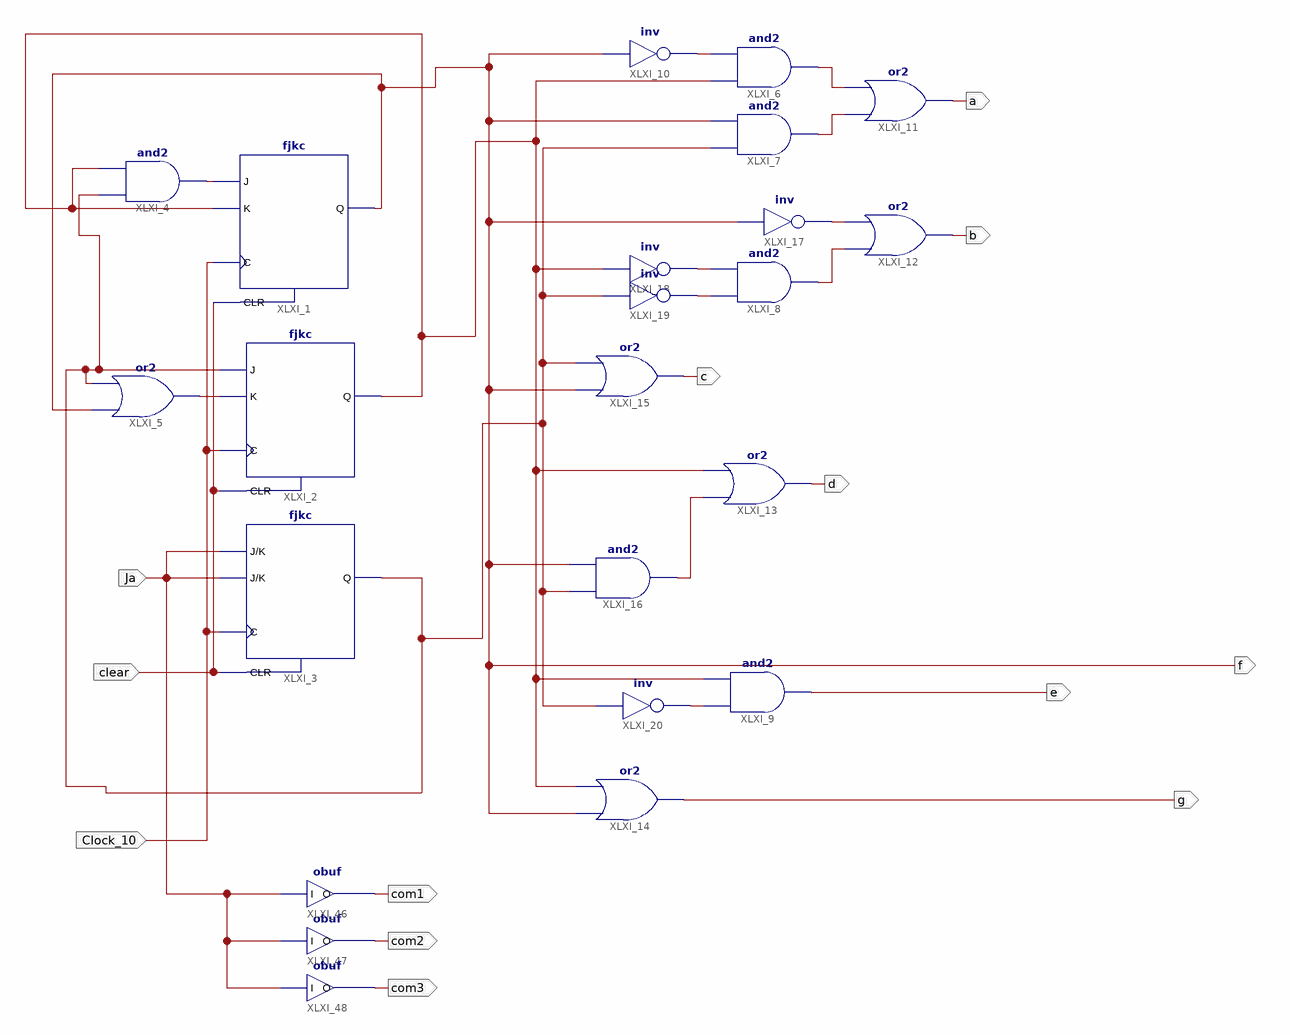
[diagram p0: schematic sheet 1]
// Xilinx ISE schematic seg7.sch (spartan6) as structural Verilog: 23 symbols, 13 ports
module seg7 (
  input  Clock_10,
  input  clear,
  input  Ja,
  output f,
  output g,
  output e,
  output d,
  output c,
  output a,
  output b,
  output com1,
  output com2,
  output com3
);

  wire XLXN_1, XLXN_2, XLXN_7, XLXN_9, XLXN_14, XLXN_15, XLXN_16, XLXN_17, XLXN_18, XLXN_19, XLXN_20,
       XLXN_30, XLXN_32;

  fjkc XLXI_1 (.C(Clock_10), .CLR(clear), .J(XLXN_1), .K(XLXN_7), .Q(f));
  fjkc XLXI_2 (.C(Clock_10), .CLR(clear), .J(XLXN_9), .K(XLXN_2), .Q(XLXN_7));
  and XLXI_4 (XLXN_1, XLXN_9, XLXN_7);
  or XLXI_5 (XLXN_2, f, XLXN_9);
  and XLXI_6 (XLXN_15, XLXN_7, XLXN_14);
  and XLXI_7 (XLXN_16, XLXN_9, f);
  and XLXI_8 (XLXN_32, XLXN_19, XLXN_18);
  and XLXI_9 (e, XLXN_20, XLXN_7);
  not XLXI_10 (XLXN_14, f);
  or XLXI_11 (a, XLXN_16, XLXN_15);
  or XLXI_12 (b, XLXN_32, XLXN_17);
  or XLXI_13 (d, XLXN_30, XLXN_7);
  or XLXI_14 (g, f, XLXN_7);
  or XLXI_15 (c, f, XLXN_9);
  and XLXI_16 (XLXN_30, XLXN_9, f);
  not XLXI_17 (XLXN_17, f);
  not XLXI_18 (XLXN_18, XLXN_7);
  not XLXI_19 (XLXN_19, XLXN_9);
  not XLXI_20 (XLXN_20, XLXN_9);
  fjkc XLXI_3 (.C(Clock_10), .CLR(clear), .J(Ja), .K(Ja), .Q(XLXN_9));
  obuf XLXI_46 (.I(Ja), .O(com1));
  obuf XLXI_47 (.I(Ja), .O(com2));
  obuf XLXI_48 (.I(Ja), .O(com3));
endmodule
